# EAGLE design RC_Engine_Sound_ESP32 (EAGLE 7.6.0)
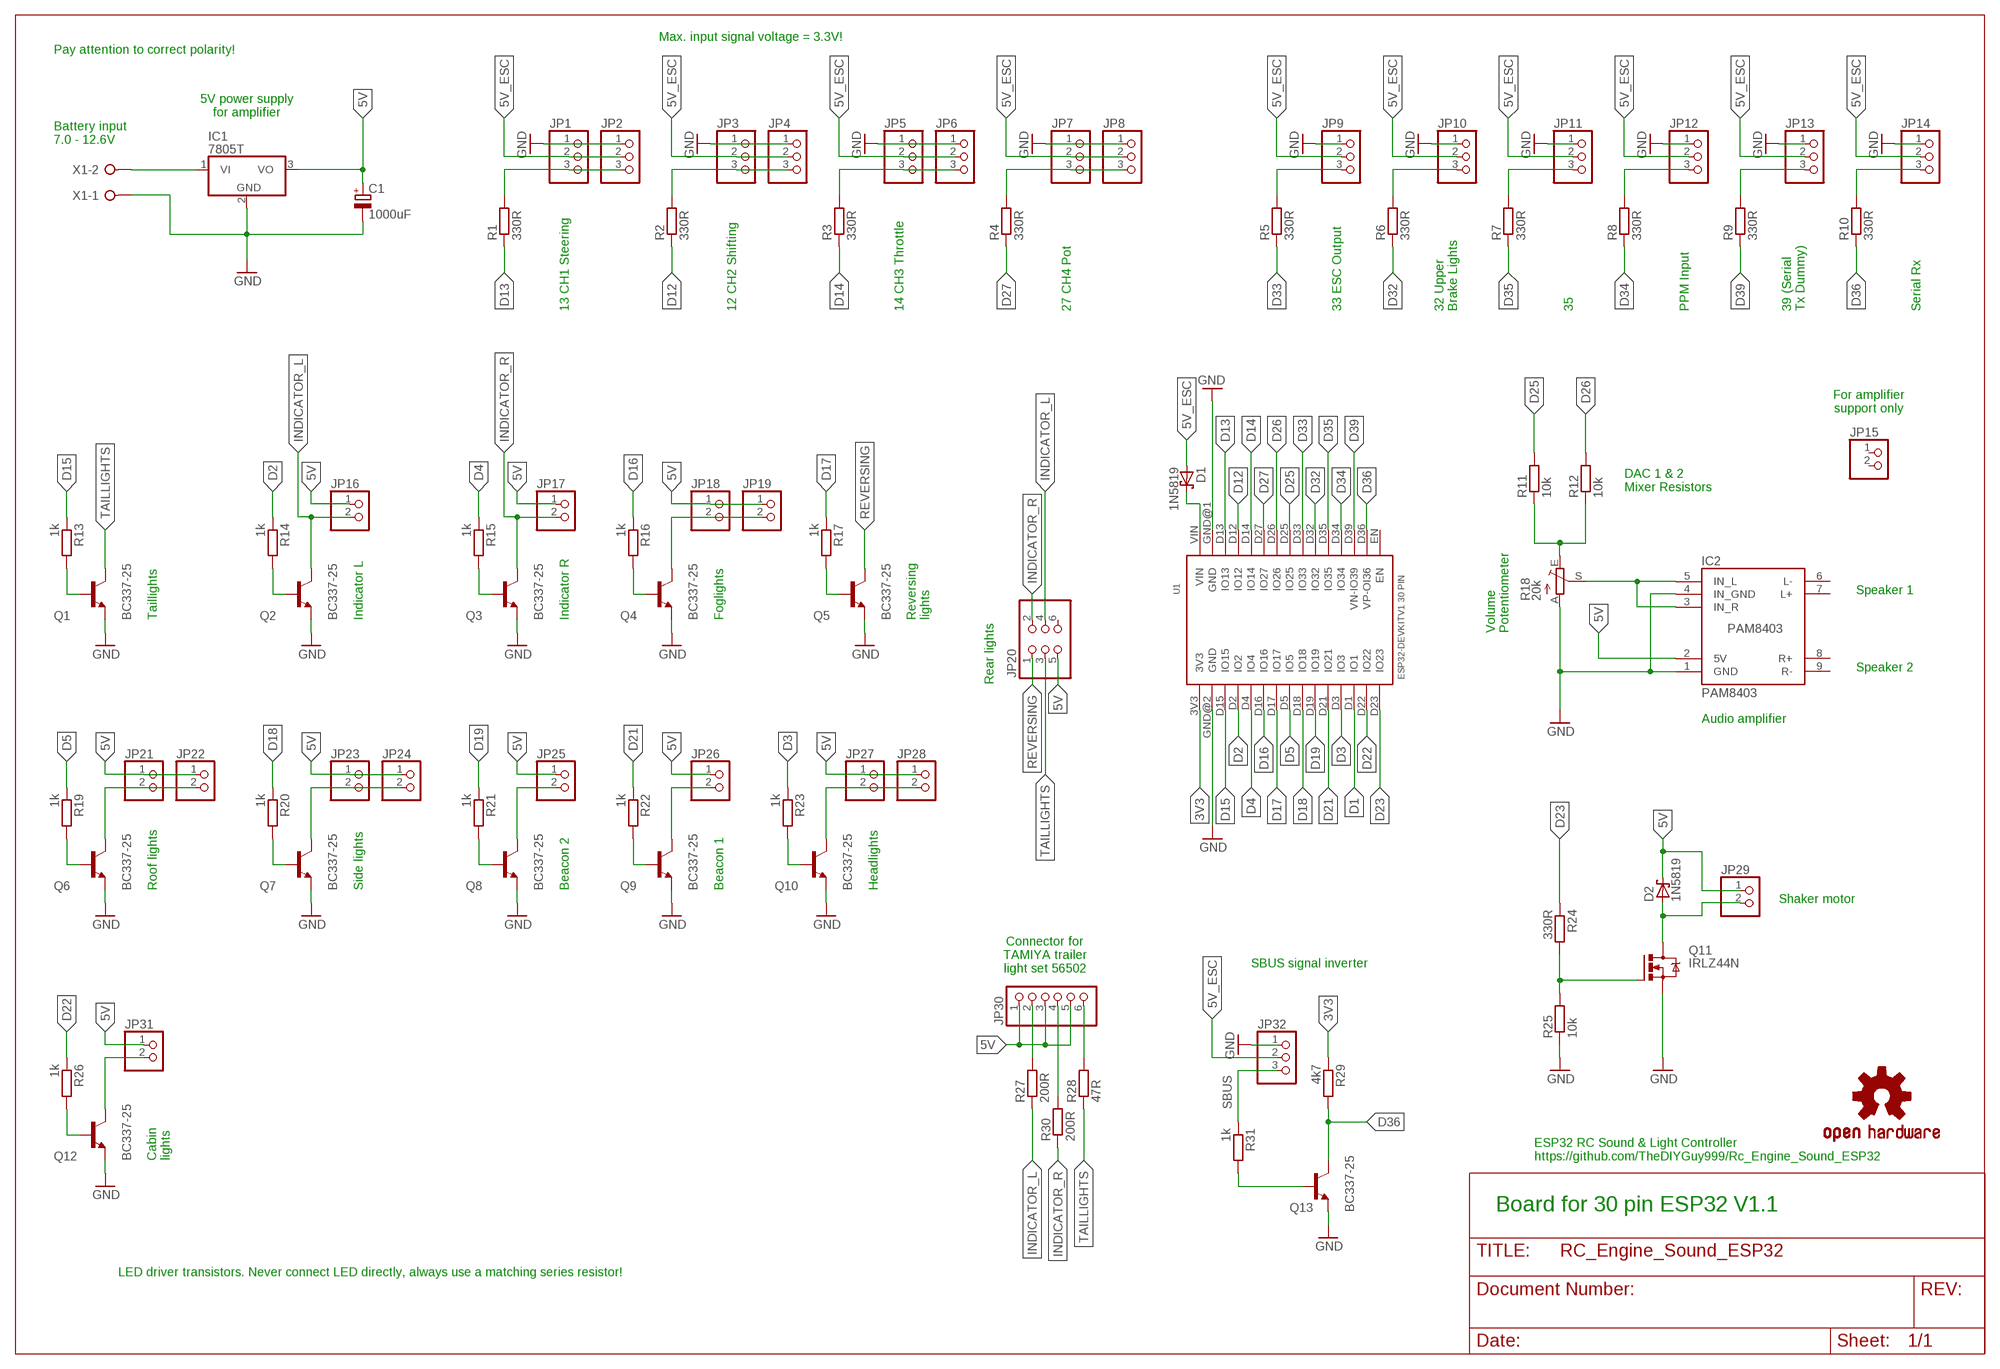
[diagram p0: schematic, sheet 1]

## Parts
C1  1000uF  CPOL-EUE5-10.5  [E5-10,5]
D1  1N5819  SCHOTTKY-DIODEDO35-7  [DO35-7]
D2  1N5819  SCHOTTKY-DIODEDO35-7  [DO35-7]
IC1  7805T  [TO220H]
IC2  PAM8403  [PAM8403]
JP1  PINHD-1X3  [1X03]
JP2  PINHD-1X3  [1X03]
JP3  PINHD-1X3  [1X03]
JP4  PINHD-1X3  [1X03]
JP5  PINHD-1X3  [1X03]
JP6  PINHD-1X3  [1X03]
JP7  PINHD-1X3  [1X03]
JP8  PINHD-1X3  [1X03]
JP9  PINHD-1X3  [1X03]
JP10  PINHD-1X3  [1X03]
JP11  PINHD-1X3  [1X03]
JP12  PINHD-1X3  [1X03]
JP13  PINHD-1X3  [1X03]
JP14  PINHD-1X3  [1X03]
JP15  PINHD-1X2  [1X02]
JP16  PINHD-1X2  [1X02]
JP17  PINHD-1X2  [1X02]
JP18  PINHD-1X2  [1X02]
JP19  PINHD-1X2  [1X02]
JP20  PINHD-2X3  [2X03]
JP21  PINHD-1X2  [1X02]
JP22  PINHD-1X2  [1X02]
JP23  PINHD-1X2  [1X02]
JP24  PINHD-1X2  [1X02]
JP25  PINHD-1X2  [1X02]
JP26  PINHD-1X2  [1X02]
JP27  PINHD-1X2  [1X02]
JP28  PINHD-1X2  [1X02]
JP29  PINHD-1X2  [1X02]
JP30  PINHD-1X6  [1X06]
JP31  PINHD-1X2  [1X02]
JP32  PINHD-1X3  [1X03]
LOGO1  OSHW-LOGOM  [OSHW-LOGO-M]
Q1  BC337-25  [TO92]
Q2  BC337-25  [TO92]
Q3  BC337-25  [TO92]
Q4  BC337-25  [TO92]
Q5  BC337-25  [TO92]
Q6  BC337-25  [TO92]
Q7  BC337-25  [TO92]
Q8  BC337-25  [TO92]
Q9  BC337-25  [TO92]
Q10  BC337-25  [TO92]
Q11  IRLZ44N  IRF540  [TO220BV]
Q12  BC337-25  [TO92]
Q13  BC337-25  [TO92]
R1  330R  R-EU_0207/2V  [0207/2V]
R2  330R  R-EU_0207/2V  [0207/2V]
R3  330R  R-EU_0207/2V  [0207/2V]
R4  330R  R-EU_0207/2V  [0207/2V]
R5  330R  R-EU_0207/2V  [0207/2V]
R6  330R  R-EU_0207/2V  [0207/2V]
R7  330R  R-EU_0207/2V  [0207/2V]
R8  330R  R-EU_0207/2V  [0207/2V]
R9  330R  R-EU_0207/2V  [0207/2V]
R10  330R  R-EU_0207/2V  [0207/2V]
R11  10k  R-EU_0207/10  [0207/10]
R12  10k  R-EU_0207/10  [0207/10]
R13  1k  R-EU_0207/2V  [0207/2V]
R14  1k  R-EU_0207/2V  [0207/2V]
R15  1k  R-EU_0207/2V  [0207/2V]
R16  1k  R-EU_0207/2V  [0207/2V]
R17  1k  R-EU_0207/2V  [0207/2V]
R18  20k  TRIM_EU-S64W  [S64W]
R19  1k  R-EU_0207/2V  [0207/2V]
R20  1k  R-EU_0207/2V  [0207/2V]
R21  1k  R-EU_0207/2V  [0207/2V]
R22  1k  R-EU_0207/2V  [0207/2V]
R23  1k  R-EU_0207/2V  [0207/2V]
R24  330R  R-EU_0207/2V  [0207/2V]
R25  10k  R-EU_0207/2V  [0207/2V]
R26  1k  R-EU_0207/2V  [0207/2V]
R27  200R  R-EU_0207/10  [0207/10]
R28  47R  R-EU_0207/10  [0207/10]
R29  4k7  R-EU_0207/2V  [0207/2V]
R30  200R  R-EU_0207/10  [0207/10]
R31  1k  R-EU_0207/2V  [0207/2V]
U1  ESP32DEVKITV1  [ESP32-DEVKITV1]
X1  W237-02P  [W237-132]

## Nets
3V3: R29.1 U1.3V3
5V: C1.+ D2.C IC1.3(VO) IC2.2(5V) JP16.1 JP17.1 JP18.1 JP19.1 JP20.5 JP21.1 JP22.1 JP23.1 JP24.1 JP25.1 JP26.1 JP27.1 JP28.1 JP29.1 JP30.1 JP30.3 JP30.5 JP31.1
5V_ESC: D1.A JP1.2 JP2.2 JP3.2 JP4.2 JP5.2 JP6.2 JP7.2 JP8.2 JP9.2 JP10.2 JP11.2 JP12.2 JP13.2 JP14.2 JP32.2
BAT+: IC1.1(VI) X1.2
D1: U1.D1(IO1)
D2: R14.1 U1.D2(IO2)
D3: R23.1 U1.D3(IO3)
D4: R15.1 U1.D4(IO4)
D5: R19.1 U1.D5(IO5)
D12: R2.1 U1.D12(IO12)
D13: R1.1 U1.D13(IO13)
D14: R3.1 U1.D14(IO14)
D15: R13.1 U1.D15(IO15)
D16: R16.1 U1.D16(IO16)
D17: R17.1 U1.D17(IO17)
D18: R20.1 U1.D18(IO18)
D19: R21.1 U1.D19(IO19)
D21: R22.1 U1.D21(IO21)
D22: R26.1 U1.D22(IO22)
D23: R24.1 U1.D23(IO23)
D25: R11.2 U1.D25(IO25)
D26: R12.2 U1.D26(IO26)
D27: R4.1 U1.D27(IO27)
D32: R6.1 U1.D32(IO32)
D33: R5.1 U1.D33(IO33)
D34: R8.1 U1.D34(IO34)
D35: R7.1 U1.D35(IO35)
D36: Q13.3(C) R10.1 R29.2 U1.D36(VP-OI36)
D39: R9.1 U1.D39(VN-IO39)
GND: C1.- IC1.2(GND) IC2.1(GND) IC2.4(IN_GND) JP1.1 JP2.1 JP3.1 JP4.1 JP5.1 JP6.1 JP7.1 JP8.1 JP9.1 JP10.1 JP11.1 JP12.1 JP13.1 JP14.1 JP32.1 Q1.1(E) Q2.1(E) Q3.1(E) Q4.1(E) Q5.1(E) Q6.1(E) Q7.1(E) Q8.1(E) Q9.1(E) Q10.1(E) Q11.S Q12.1(E) Q13.1(E) R18.A R25.1 U1.GND@1(GND) U1.GND@2(GND) X1.1
INDICATOR_L: JP16.2 JP20.4 Q2.3(C) R27.1
INDICATOR_R: JP17.2 JP20.2 Q3.3(C) R30.1
N$1: IC2.3(IN_R) IC2.5(IN_L) R18.S
N$2: R11.1 R12.1 R18.E
N$3: JP1.3 JP2.3 R1.2
N$4: Q11.G R24.2 R25.2
N$5: JP3.3 JP4.3 R2.2
N$6: JP5.3 JP6.3 R3.2
N$7: JP7.3 JP8.3 R4.2
N$8: JP9.3 R5.2
N$9: D1.C U1.VIN
N$10: JP10.3 R6.2
N$11: JP11.3 R7.2
N$12: JP12.3 R8.2
N$13: JP13.3 R9.2
N$14: JP14.3 R10.2
N$15: D2.A JP29.2 Q11.D
N$16: Q10.2(B) R23.2
N$17: Q4.2(B) R16.2
N$18: JP27.2 JP28.2 Q10.3(C)
N$19: JP18.2 JP19.2 Q4.3(C)
N$20: Q1.2(B) R13.2
N$21: JP30.2 R27.2
N$22: Q2.2(B) R14.2
N$23: JP30.4 R30.2
N$24: Q3.2(B) R15.2
N$25: JP30.6 R28.2
N$26: Q5.2(B) R17.2
N$27: Q6.2(B) R19.2
N$28: JP21.2 JP22.2 Q6.3(C)
N$29: Q7.2(B) R20.2
N$30: JP23.2 JP24.2 Q7.3(C)
N$31: Q8.2(B) R21.2
N$32: JP25.2 Q8.3(C)
N$33: Q9.2(B) R22.2
N$34: JP26.2 Q9.3(C)
N$35: Q12.2(B) R26.2
N$36: JP31.2 Q12.3(C)
N$37: Q13.2(B) R31.2
REVERSING: JP20.1 Q5.3(C)
SBUS: JP32.3 R31.1
TAILLIGHTS: JP20.3 Q1.3(C) R28.1
Unconnected: IC2.6(L-) IC2.7(L+) IC2.8(R+) IC2.9(R-) JP15.1 JP15.2 JP20.6 U1.EN

## Notes on the sheet
- Max. input signal voltage = 3.3V!
- Pay attention to correct polarity!
- 5V power supply
  for amplifier
- Battery input
  7.0 - 12.6V
- 13 CH1 Steering | 12 CH2 Shifting | 14 CH3 Throttle | 27 CH4 Pot | 33 ESC Output
- 32 Upper
  Brake Lights
- 35 | PPM Input
- 39 (Serial
  Tx Dummy)
- Serial Rx
- For amplifier
  support only
- DAC 1 & 2
  Mixer Resistors
- Speaker 1
- Taillights | Indicator L | Indicator R | Foglights
- Reversing
  lights
- Volume
  Potentiometer
- Speaker 2
- Rear lights
- Audio amplifier
- Roof lights | Side lights | Beacon 2 | Beacon 1 | Headlights
- Shaker motor
- Connector for
  TAMIYA trailer
  light set 56502
- SBUS signal inverter
- Cabin
  lights
- ESP32 RC Sound & Light Controller
  https://github.com/TheDIYGuy999/Rc_Engine_Sound_ESP32
- Board for 30 pin ESP32 V1.1
- LED driver transistors. Never connect LED directly, always use a matching series resistor!

## Library data of the parts
C1 = rcl:CPOL-EU: POLARIZED CAPACITOR, European symbol
D1 D2 = diode:SCHOTTKY-DIODE: Schottky Diode
IC1 = linear:78*: Positive VOLTAGE REGULATOR Source: http://cache.national.com/ds/LM/LM78L05.pdf http://www.fairchildsemi.com/ds/LM/LM7805.pdf
IC2 = 00_custom:PAM8403: 2Channel 3W DC 2.5-5V Class D Amplifier Board
JP1-JP14 JP32 = 00_custom_pinhead:PINHD-1X3: PIN HEADER
JP15-JP19 JP21-JP29 JP31 = 00_custom_pinhead:PINHD-1X2: PIN HEADER
JP20 = 00_custom_pinhead:PINHD-2X3: PIN HEADER
JP30 = 00_custom_pinhead:PINHD-1X6: PIN HEADER
LOGO1 = SparkFun-Aesthetics:OSHW-LOGO: Open Source Hardware Logo This logo indicates the piece of hardware it is found on incorporates a OSHW license and/or adheres to the definition of open source hardware found here: http://freedomdefined.org/OSHW
Q1-Q10 Q12 Q13 = transistor-npn:BC337*: NPN Transistor
Q11 = transistor-power:IRF540: HEXFET Power MOSFET
R1-R17 R19-R31 = rcl:R-EU_: RESISTOR, European symbol
R18 = pot:TRIM_EU-: POTENTIOMETER
U1 = ESP32-DEVKITV1_30pin:ESP32DEVKITV1
X1 = con-wago-508:W237-02P: WAGO SREW CLAMP; OC_FARNELL: unknown; OC_NEWARK: unknown

## Net classes
0 5V: clearance 0.254 mm

## Board
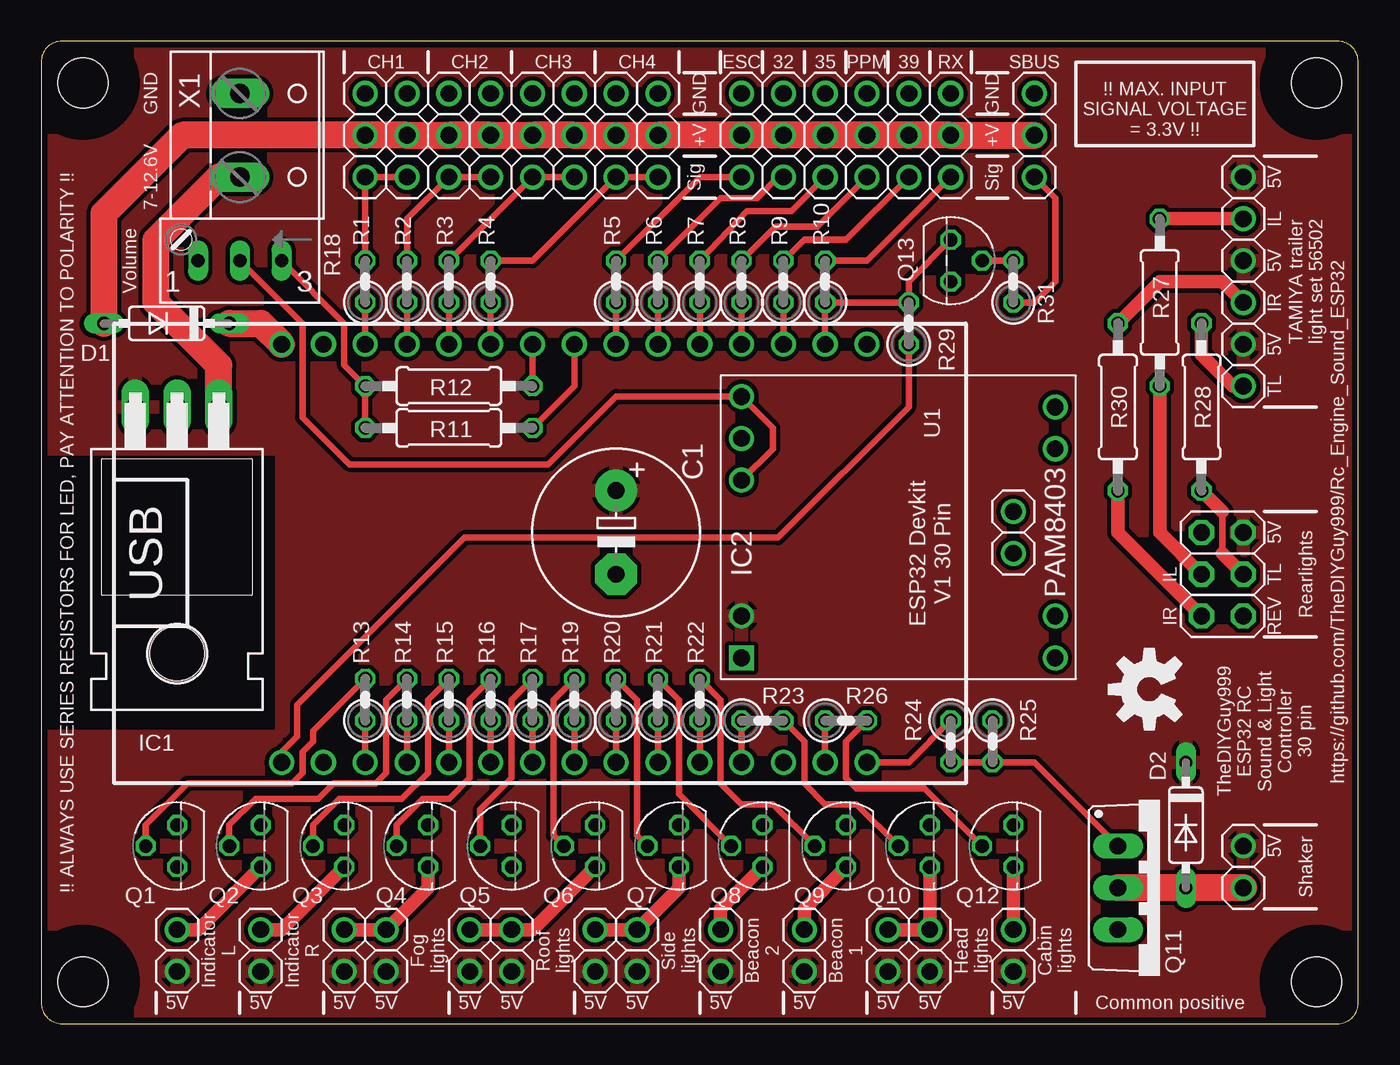
[diagram p1: board, top side]
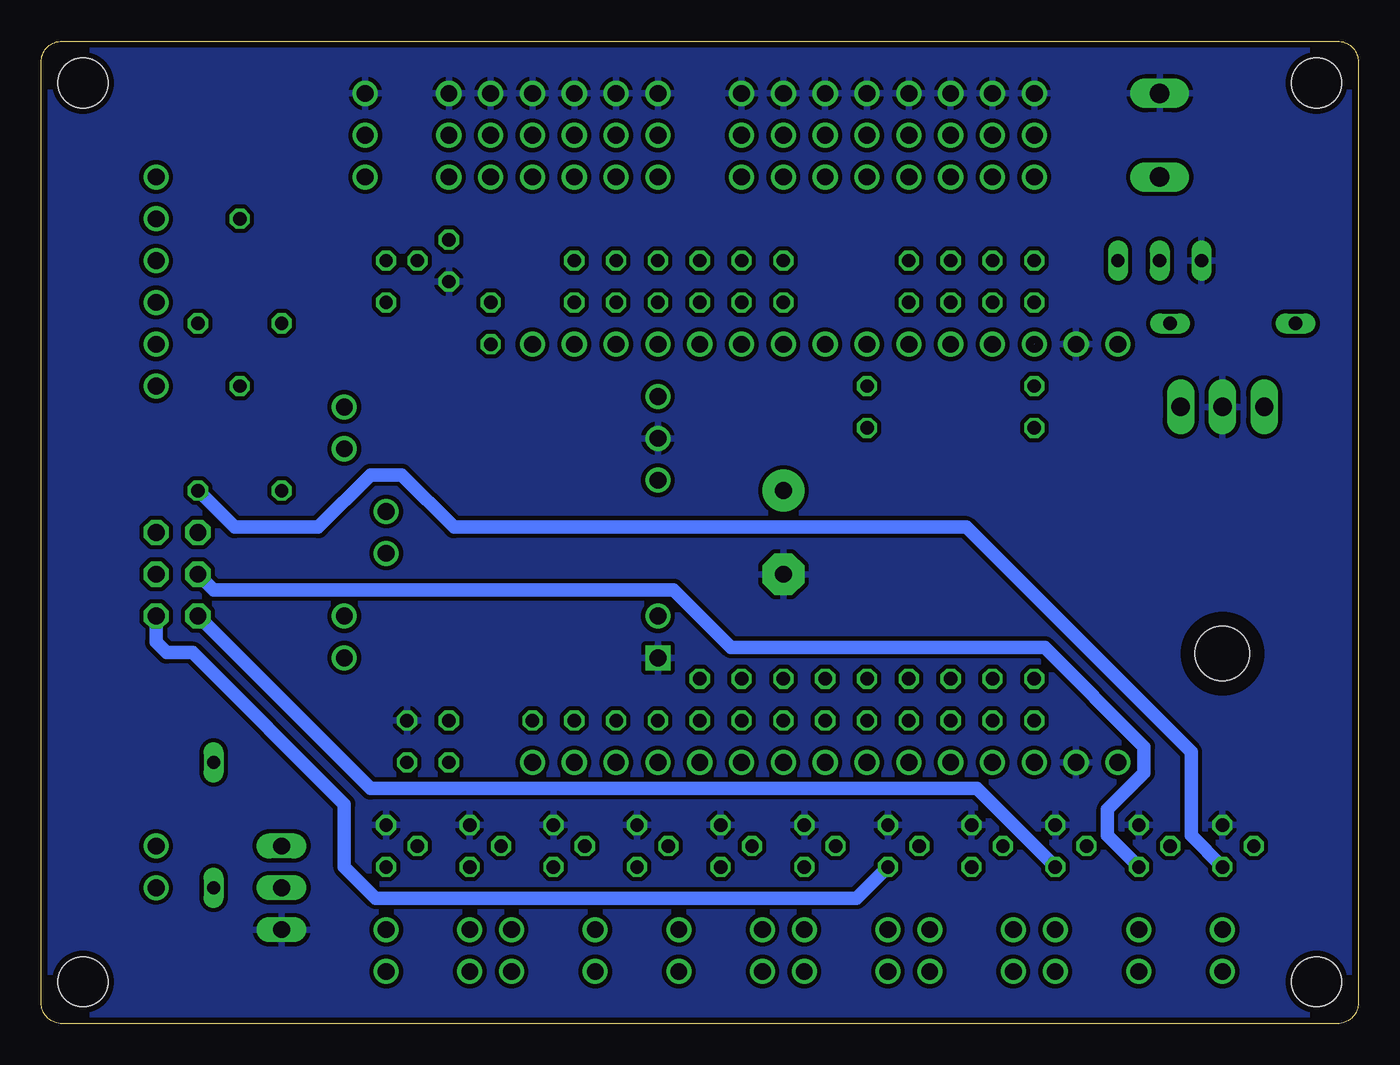
[diagram p2: board, bottom side, seen from below]

Size 80.01 x 59.69 mm. Coordinates in mm from the lower left corner, seen from the top.
Outline: 0,58.42 0,1.27 arc90 1.27,0 78.74,0 arc90 80.01,1.27 80.01,58.42 arc90 78.74,59.69 1.27,59.69 arc90 0,58.42
Copper layers (1*16): Top 0.0356mm / dielectric 1.5011mm / Bottom 0.0356mm
Design rules "OSHPark_LaenPCBOrder": minimum track width 6mil, minimum drill 13mil, track to track 6mil, track to pad 6mil, pad to pad 6mil, via to via 6mil, smd to smd 6mil, copper to edge 15mil, drill to drill 6mil, minimum pad ring 7mil, minimum via ring 7mil, stop-mask expansion 3mil, vias tented up to drill 0mil, thermal gap 10mil
Holes 3 mm at 2.54,57.15 2.54,2.54 77.47,2.54 77.47,57.15
tRestrict: area -0.7,53.9 to 5.8,60.4; area 74.2,53.9 to 80.7,60.4; area 74.2,-0.7 to 80.7,5.8; area -0.7,-0.7 to 5.8,5.8

### Footprints (pad centres in the part's own frame; a part is rotated, then mirrored left to right if it is on the bottom)
E5-10,5 = drill 1.016 pad 2.54: + -2.54,0 | drill 1.016 pad 2.54 octagon: - 2.54,0
DO35-7 = drill 0.813 long: A 3.81,0; C -3.81,0
TO220H = drill 1.118 long: 1 -2.54,-10.16; 2 0,-10.16; 3 2.54,-10.16 | hole 3.302: 0,4.826
PAM8403 = drill 1.016 square: 1 -7.62,8.89 | drill 1.016: 2 -5.08,8.89; 3 3.175,8.89; 4 5.715,8.89; 5 8.255,8.89; 6 7.62,-10.16; 7 5.08,-10.16; 8 -5.08,-10.16; 9 -7.62,-10.16
1X03 = drill 1.016 pad 1.524: 1 -2.54,0; 2 0,0; 3 2.54,0
1X02 = drill 1.016 pad 1.524: 1 -1.27,0; 2 1.27,0
2X03 = drill 1.016 octagon: 1 -2.54,-1.27; 2 -2.54,1.27; 3 0,-1.27; 4 0,1.27; 5 2.54,-1.27; 6 2.54,1.27
1X06 = drill 1.016 pad 1.524: 1 -6.35,0; 2 -3.81,0; 3 -1.27,0; 4 1.27,0; 5 3.81,0; 6 6.35,0
TO92 = drill 0.813 octagon: 1 1.27,0; 2 0,1.905; 3 -1.27,0
TO220BV = drill 1.016 long: D 0,-2.54; G -2.54,-2.54; S 2.54,-2.54
0207/2V = drill 0.813 octagon: 1 -1.27,0; 2 1.27,0
0207/10 = drill 0.813 octagon: 1 -5.08,0; 2 5.08,0
S64W = drill 0.813 long: A 2.54,1.27; E -2.54,1.27; S 0,1.27
ESP32-DEVKITV1 = drill 1.016: 3V3 -16.51,-12.7; D1 13.97,-12.7; D2 -8.89,-12.7; D3 11.43,-12.7; D4 -6.35,-12.7; D5 1.27,-12.7; D12 -8.89,12.7; D13 -11.44,12.7; D14 -6.35,12.7; D15 -11.43,-12.7; D16 -3.81,-12.7; D17 -1.27,-12.7; D18 3.81,-12.7; D19 6.35,-12.7; D21 8.89,-12.7; D22 16.51,-12.7; D23 19.05,-12.7; D25 1.27,12.7; D26 -1.27,12.7; D27 -3.81,12.7; D32 6.35,12.7; D33 3.81,12.7; D34 11.43,12.7; D35 8.89,12.7; D36 16.51,12.7; D39 13.97,12.7; EN 19.05,12.7; GND@1 -13.97,12.7; GND@2 -13.97,-12.7; VIN -16.51,12.7
W237-132 = drill 1.194 long: 1 -2.54,-0.635; 2 2.54,-0.635

### Placement (x,y rotation side)
C1  34.93,29.85 270 top
D1  7.62,42.54 180 top
D2  69.53,12.06 270 top
IC1  8.26,27.31 180 top
IC2  51.44,29.85 90 top
JP1  19.68,53.98 270 top
JP2  22.22,53.98 270 top
JP3  24.76,53.98 270 top
JP4  27.3,53.98 270 top
JP5  29.84,53.98 270 top
JP6  32.39,53.98 270 top
JP7  34.93,53.98 270 top
JP8  37.47,53.98 270 top
JP9  42.55,53.98 270 top
JP10  45.09,53.98 270 top
JP11  47.62,53.98 270 top
JP12  50.16,53.98 270 top
JP13  52.71,53.98 270 top
JP14  55.25,53.98 270 top
JP15  59.05,29.85 90 top
JP16  8.26,4.45 90 top
JP17  13.34,4.45 90 top
JP18  18.41,4.45 90 top
JP19  20.95,4.45 90 top
JP20  71.75,27.31 90 top
JP21  26.04,4.45 90 top
JP22  28.57,4.45 90 top
JP23  33.66,4.45 90 top
JP24  36.2,4.45 90 top
JP25  41.27,4.45 90 top
JP26  46.36,4.45 90 top
JP27  51.44,4.45 90 top
JP28  53.98,4.45 90 top
JP29  73.02,9.53 270 top
JP30  73.02,45.09 270 top
JP31  59.05,4.45 90 top
JP32  60.33,53.98 270 top
LOGO1  67.31,20.32 90 top
Q1  8.26,10.79 90 top
Q2  13.34,10.79 90 top
Q3  18.41,10.79 90 top
Q4  23.49,10.79 90 top
Q5  28.57,10.79 90 top
Q6  33.66,10.79 90 top
Q7  38.73,10.79 90 top
Q8  43.82,10.79 90 top
Q9  48.9,10.79 90 top
Q10  53.98,10.79 90 top
Q11  67.94,8.26 270 top
Q12  59.05,10.79 90 top
Q13  55.25,46.35 270 top
R1  19.68,45.09 90 top
R2  22.22,45.09 90 top
R3  24.76,45.09 90 top
R4  27.3,45.09 90 top
R5  34.93,45.09 90 top
R6  37.47,45.09 90 top
R7  40.01,45.09 90 top
R8  42.55,45.09 90 top
R9  45.09,45.09 90 top
R10  47.62,45.09 90 top
R11  24.76,36.2 0 top
R12  24.76,38.73 0 top
R13  19.68,19.69 90 top
R14  22.22,19.69 90 top
R15  24.76,19.69 90 top
R16  27.3,19.69 90 top
R17  29.84,19.69 90 top
R18  12.06,47.62 180 top
R19  32.39,19.69 90 top
R20  34.93,19.69 90 top
R21  37.47,19.69 90 top
R22  40.01,19.69 90 top
R23  43.82,18.42 0 top
R24  55.25,17.15 270 top
R25  57.79,17.15 270 top
R26  48.9,18.42 0 top
R27  67.94,43.81 90 top
R28  70.48,37.46 90 top
R29  10k  [0207/2V]  52.71,42.54 90 top
R30  65.41,37.46 90 top
R31  59.05,45.09 90 top
U1  31.11,28.58 0 top
X1  12.7,53.98 270 top

### Tracks (layer width: path | path; a pad name or v marks a point on that pad's centre or on a via)
3V3
  Top 0.406: R29.1 52.71,37.46 44.77,29.53 25.72,29.53 15.56,19.37 15.56,17.46 14.61,16.51 U1.3V3
5V
  pour Top: -3.17,-1.91 -3.17,17.46 14.61,17.46 14.61,34.92 -3.49,34.92 -3.17,62.86 83.18,62.86 83.18,-1.91
5V_ESC
  Top 1.626: D1.A 3.81,49.21 8.57,53.98 JP1.2 JP2.2 JP3.2 JP4.2 JP5.2 JP6.2 JP7.2 JP8.2 JP9.2 JP10.2 JP11.2 JP12.2 JP13.2 JP14.2 JP32.2
BAT+
  Top 1.626: IC1.1 10.79,40 6.99,43.81 6.99,47.62 10.79,51.43 X1.2
D2
  Top 0.406: R14.1 U1.D2
D3
  Top 0.406: R23.1 U1.D3
D4
  Top 0.406: R15.1 U1.D4
D5
  Top 0.406: R19.1 U1.D5
D12
  Top 0.406: R2.1 U1.D12
D13  (1 unrouted)
  Top 0.406: R1.1 U1.D13
D14
  Top 0.406: R3.1 U1.D14
D15
  Top 0.406: R13.1 U1.D15
D16
  Top 0.406: R16.1 U1.D16
D17
  Top 0.406: R17.1 U1.D17
D18
  Top 0.406: R20.1 U1.D18
D19
  Top 0.406: R21.1 U1.D19
D21
  Top 0.406: R22.1 U1.D21
D22
  Top 0.406: R26.1 U1.D22
D23
  Top 0.406: U1.D23 52.71,15.88 R24.1
D25
  Top 0.406: U1.D25 32.39,38.73 R11.2
D26
  Top 0.406: U1.D26 R12.2
D27
  Top 0.406: R4.1 U1.D27
D32
  Top 0.406: R6.1 U1.D32
D33
  Top 0.406: R5.1 U1.D33
D34
  Top 0.406: R8.1 U1.D34
D35
  Top 0.406: R7.1 U1.D35
D36
  Top 0.406: U1.D36 R10.1 R29.2 52.71,45.09 Q13.3
D39
  Top 0.406: R9.1 U1.D39
GND
  pour Bottom: -1.91,61.59 81.91,61.59 81.91,-1.91 -1.91,-1.91
INDICATOR_L
  Top 0.813: R27.1 67.94,29.85 JP20.4 | Q2.3 9.53,5.71 JP16.2
  Bottom 0.813: Q2.3 15.24,11.43 15.24,13.02 13.02,15.24 13.02,16.83 19.05,22.86 38.1,22.86 41.59,26.35 69.53,26.35 JP20.4
INDICATOR_R
  Top 0.813: R30.1 65.41,29.85 JP20.2 | Q3.3 14.61,5.71 JP17.2
  Bottom 0.813: Q3.3 23.18,14.29 60.01,14.29 JP20.2
N$1
  Top 0.406: R18.S 15.88,42.54 15.88,36.83 18.73,33.97 30.8,33.97 34.93,38.1 IC2.5 44.45,36.2 44.45,34.92 IC2.3
N$2
  Top 0.406: R11.1 R12.1 18.41,40 18.41,42.54 R18.E
N$3
  Top 0.406: R1.2 JP1.3 JP2.3
N$4
  Top 0.406: Q11.G 60.33,15.88 R25.2 R24.2
N$5
  Top 0.406: R2.2 22.22,48.89 JP3.3 JP4.3
N$6
  Top 0.406: R3.2 JP5.3 JP6.3
N$7
  Top 0.406: R4.2 29.84,46.35 JP7.3 JP8.3
N$8
  Top 0.406: JP9.3 40.01,51.43 R5.2
N$9
  Top 1.626: D1.C 13.34,42.54 U1.VIN
N$10
  Top 0.406: JP10.3 44.77,51.43 43.5,50.16 41.27,50.16 R6.2
N$11
  Top 0.406: JP11.3 45.56,49.37 42.86,49.37 R7.2
N$12
  Top 0.406: JP12.3 47.15,48.42 44.61,48.42 R8.2
N$13
  Top 0.406: JP13.3 48.9,47.62 46.36,47.62 R9.2
N$14
  Top 0.406: JP14.3 50.16,46.35 R10.2
N$15
  Top 1.626: JP29.2 D2.A Q11.D
N$16
  Top 0.406: R23.2 46.36,17.15 46.36,14.61 47.62,13.33 49.53,13.33 Q10.2
N$17
  Top 0.406: R16.2 26.04,19.69 26.04,14.92 24.76,13.65 23.18,13.65 21.59,12.06 Q4.2
N$18
  Top 0.813: JP27.2 JP28.2 Q10.3
N$19
  Top 0.813: JP18.2 JP19.2 23.49,8.26 Q4.3
N$20
  Top 0.406: R13.2 16.51,17.78 16.51,17.15 15.88,16.51 15.88,15.24 15.24,14.61 8.89,14.61 6.35,12.06 Q1.2
N$21
  Top 0.813: R27.2 JP30.2
N$22
  Top 0.406: R14.2 20.95,19.69 20.95,15.24 20.32,14.61 17.78,14.61 16.83,13.65 13.02,13.65 11.43,12.06 Q2.2
N$23
  Top 0.813: R30.2 67.94,45.09 71.75,45.09 JP30.4
N$24
  Top 0.406: R15.2 23.49,19.69 23.49,15.24 21.91,13.65 18.1,13.65 16.51,12.06 Q3.2
N$25
  Top 0.813: JP30.6 72.39,38.73 70.48,40.64 R28.2
N$26
  Top 0.406: R17.2 28.57,19.69 28.57,14.92 26.67,13.02 Q5.2
N$27
  Top 0.406: R19.2 31.11,19.69 31.11,11.43 Q6.2
N$28
  Top 0.813: JP21.2 JP22.2 29.84,5.71 Q6.3
N$29
  Top 0.406: R20.2 36.2,19.69 36.2,11.43 Q7.2
N$30
  Top 0.813: JP23.2 JP24.2 38.73,8.26 Q7.3
N$31
  Top 0.406: R21.2 38.73,19.69 38.73,13.97 Q8.2
N$32
  Top 0.813: JP25.2 41.27,6.98 Q8.3
N$33
  Top 0.406: R22.2 41.27,19.69 41.27,14.61 42.55,13.33 44.45,13.33 Q9.2
N$34
  Top 0.813: JP26.2 46.36,6.98 Q9.3
N$35
  Top 0.406: R26.2 48.9,17.15 48.9,14.92 49.53,14.29 53.66,14.29 Q12.2
N$36
  Top 0.813: JP31.2 Q12.3
N$37
  Top 0.406: Q13.2 R31.2
REVERSING
  Bottom 0.813: Q5.3 30.48,7.62 59.69,7.62 61.59,9.53 61.59,13.33 70.8,22.54 72.39,22.54 73.02,23.18 JP20.1
SBUS
  Top 0.406: JP32.3 61.59,50.16 61.59,45.09 60.33,43.81 R31.1
TAILLIGHTS
  Top 0.406: 71.75,31.12 71.75,28.58
  Top 0.813: R28.1 71.75,31.12 | 71.75,28.58 JP20.3
  Bottom 0.813: Q1.3 10.16,11.43 10.16,16.51 23.81,30.16 54.93,30.16 58.1,33.34 60.01,33.34 63.18,30.16 68.26,30.16 R28.1

### Text on the board
tNames: CH1 | CH2 | CH3 | CH4 | ESC | 32 | 35 | PPM | 39 | RX | SBUS | GND | GND | GND | !! MAX. INPUT / SIGNAL VOLTAGE / = 3.3V !! | +V | +V | 7-12.6V | Sig | Sig | 5V | IL | Volume | 5V | TAMIYA trailer / light set 56502 | IR | 5V | TL | https://github.com/TheDIYGuy999/Rc_Engine_Sound_ESP32 | !! ALWAYS USE SERIES RESISTORS FOR LED, PAY ATTENTION TO POLARITY !! | 5V | IL | TL | Rearlights | IR | REV | TheDIYGuy999 / ESP32 RC / Sound & Light / Controller / 30 pin | 5V | Shaker | Indicator / L | Indicator / R | Fog / lights | Roof / lights | Side / lights | Beacon / 2 | Beacon / 1 | Head / lights | Cabin / lights | 5V | 5V | 5V | 5V | 5V | 5V | 5V | 5V | 5V | 5V | 5V | 5V | 5V | Common positive